# Altium schematic sheet PowerControl.SchDoc
size C
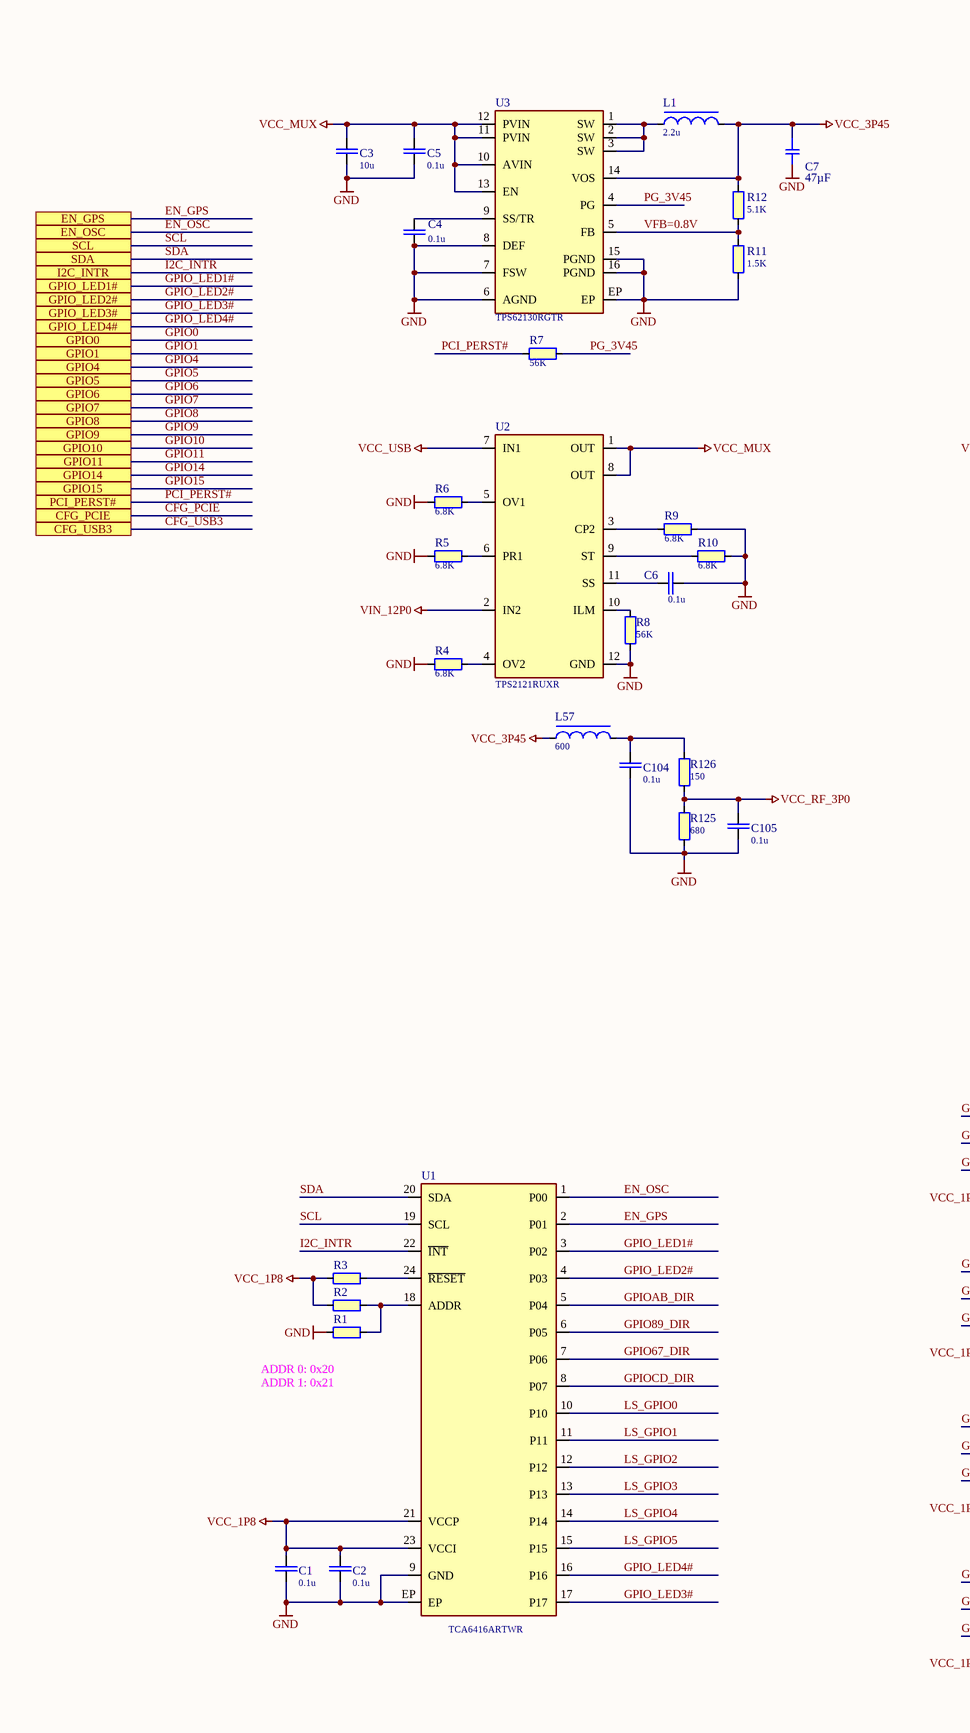
[diagram p0: PowerControl.SchDoc, left]
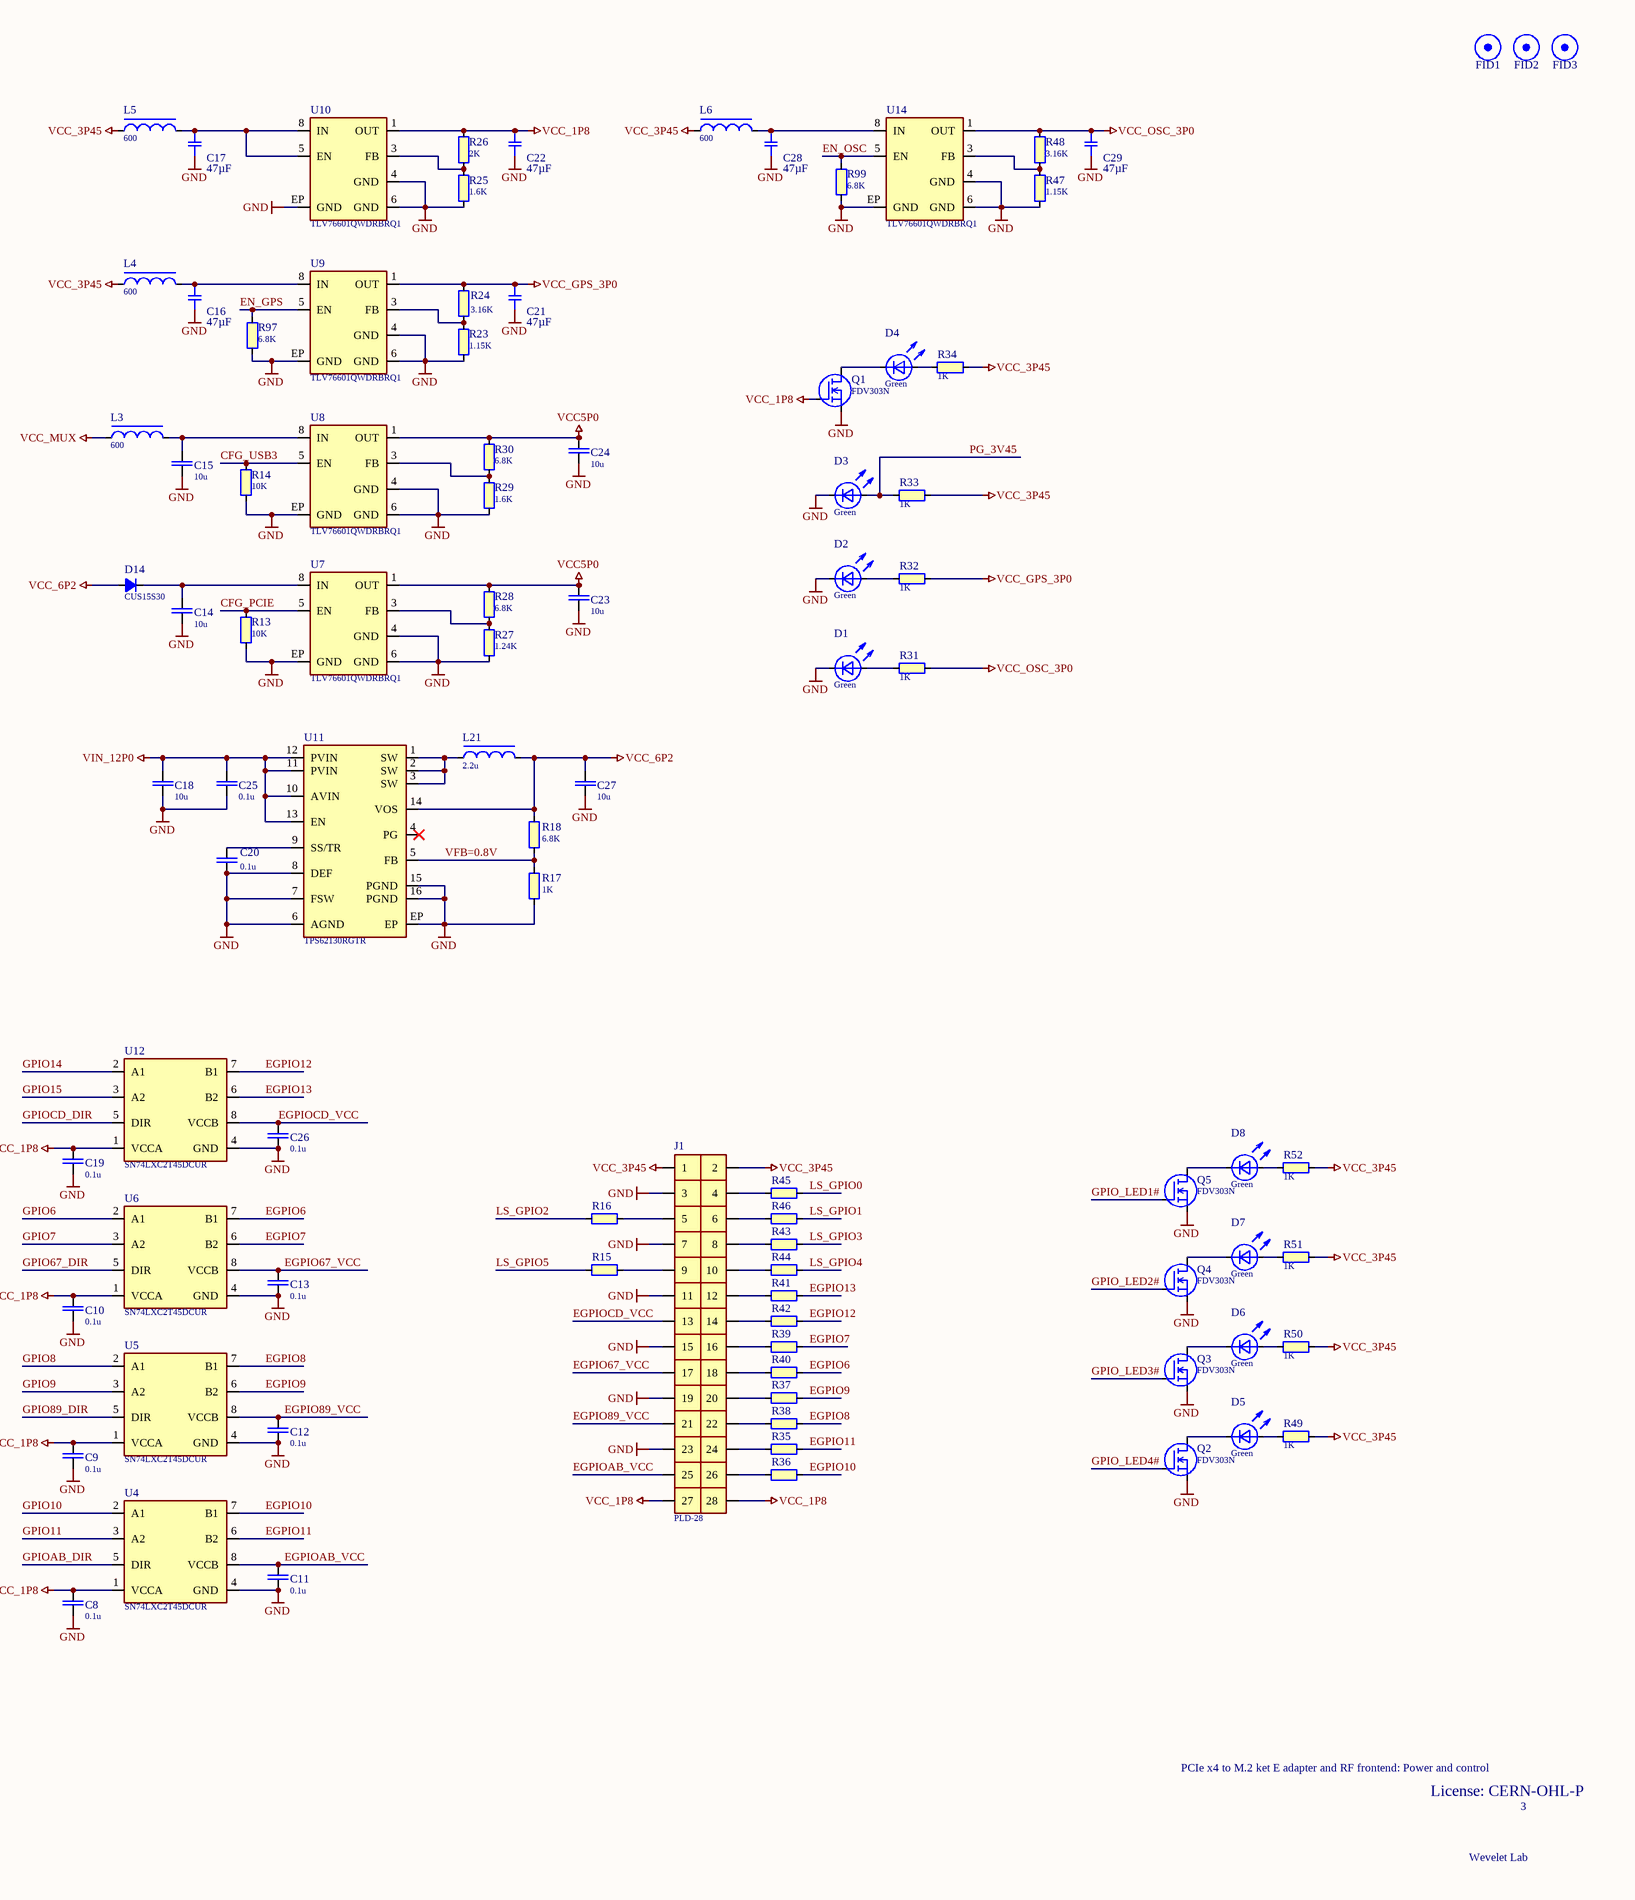
[diagram p1: PowerControl.SchDoc, right]

## Parts
C1  value 0.1u  [CAPC100X50X55L25N]  (hidden comment: GRM155R71E104KE14D)
C2  value 0.1u  [CAPC100X50X55L25N]  (hidden comment: GRM155R71E104KE14D)
C3  value 10u  [CAPC160X80X100L40N]  (hidden comment: Cap-0603-X5R-25V-10u-20%)
C4  value 0.1u  [CAPC100X50X55L25N]  (hidden comment: GRM155R71E104KE14D)
C5  value 0.1u  [CAPC100X50X55L25N]  (hidden comment: GRM155R71E104KE14D)
C6  value 0.1u  [CAPC100X50X55L25N]  (hidden comment: GRM155R71E104KE14D)
C7  value 47µF  [SMD-0603-CAP_HighDensity]  (hidden comment: GRM188C80G476ME01D)
C8  value 0.1u  [CAPC100X50X55L25N]  (hidden comment: GRM155R71E104KE14D)
C9  value 0.1u  [CAPC100X50X55L25N]  (hidden comment: GRM155R71E104KE14D)
C10  value 0.1u  [CAPC100X50X55L25N]  (hidden comment: GRM155R71E104KE14D)
C11  value 0.1u  [CAPC100X50X55L25N]  (hidden comment: GRM155R71E104KE14D)
C12  value 0.1u  [CAPC100X50X55L25N]  (hidden comment: GRM155R71E104KE14D)
C13  value 0.1u  [CAPC100X50X55L25N]  (hidden comment: GRM155R71E104KE14D)
C14  value 10u  [CAPC160X80X100L40N]  (hidden comment: Cap-0603-X5R-25V-10u-20%)
C15  value 10u  [CAPC160X80X100L40N]  (hidden comment: Cap-0603-X5R-25V-10u-20%)
C16  value 47µF  [SMD-0603-CAP_HighDensity]  (hidden comment: GRM188C80G476ME01D)
C17  value 47µF  [SMD-0603-CAP_HighDensity]  (hidden comment: GRM188C80G476ME01D)
C18  value 10u  [CAPC160X80X100L40N]  (hidden comment: Cap-0603-X5R-25V-10u-20%)
C19  value 0.1u  [CAPC100X50X55L25N]  (hidden comment: GRM155R71E104KE14D)
C20  value 0.1u  [CAPC100X50X55L25N]  (hidden comment: GRM155R71E104KE14D)
C21  value 47µF  [SMD-0603-CAP_HighDensity]  (hidden comment: GRM188C80G476ME01D)
C22  value 47µF  [SMD-0603-CAP_HighDensity]  (hidden comment: GRM188C80G476ME01D)
C23  value 10u  [CAPC160X80X100L40N]  (hidden comment: Cap-0603-X5R-25V-10u-20%)
C24  value 10u  [CAPC160X80X100L40N]  (hidden comment: Cap-0603-X5R-25V-10u-20%)
C25  value 0.1u  [CAPC100X50X55L25N]  (hidden comment: GRM155R71E104KE14D)
C26  value 0.1u  [CAPC100X50X55L25N]  (hidden comment: GRM155R71E104KE14D)
C27  value 10u  [CAPC160X80X100L40N]  (hidden comment: Cap-0603-X5R-25V-10u-20%)
C28  value 47µF  [SMD-0603-CAP_HighDensity]  (hidden comment: GRM188C80G476ME01D)
C29  value 47µF  [SMD-0603-CAP_HighDensity]  (hidden comment: GRM188C80G476ME01D)
C104  value 0.1u  [CAPC100X50X55L25N]  (hidden comment: GRM155R71E104KE14D)
C105  value 0.1u  [CAPC100X50X55L25N]  (hidden comment: GRM155R71E104KE14D)
D1  value Green  [LEDC160X80X80L40N-Green]  (hidden comment: LTST-C190KGKT)
D2  value Green  [LEDC160X80X80L40N-Green]  (hidden comment: LTST-C190KGKT)
D3  value Green  [LEDC160X80X80L40N-Green]  (hidden comment: LTST-C190KGKT)
D4  value Green  [LEDC160X80X80L40N-Green]  (hidden comment: LTST-C190KGKT)
D5  value Green  [LEDC160X80X80L40N-Green]  (hidden comment: LTST-C190KGKT)
D6  value Green  [LEDC160X80X80L40N-Green]  (hidden comment: LTST-C190KGKT)
D7  value Green  [LEDC160X80X80L40N-Green]  (hidden comment: LTST-C190KGKT)
D8  value Green  [LEDC160X80X80L40N-Green]  (hidden comment: LTST-C190KGKT)
D14  value CUS15S30  [INDC100X60X60L30N]  (hidden comment: CUS15S30,H3F)
FID1  Fiducial  [Fiducial_3D]  (value not drawn)  (no BOM)
FID2  Fiducial  [Fiducial_3D]  (value not drawn)  (no BOM)
FID3  Fiducial  [Fiducial_3D]  (value not drawn)  (no BOM)
J1  PLD-28  [PLD-28]
L1  value 2.2u  [IND_TAIYO_NRS5020]  (hidden comment: NRS5020T2R2NMGJ)
L3  value 600  [INDC100X60X60L30N]  (hidden comment: BLM15HG601SN1D)
L4  value 600  [INDC100X60X60L30N]  (hidden comment: BLM15HG601SN1D)
L5  value 600  [INDC100X60X60L30N]  (hidden comment: BLM15HG601SN1D)
L6  value 600  [INDC100X60X60L30N]  (hidden comment: BLM15HG601SN1D)
L21  value 2.2u  [IND_TAIYO_NRS5020]  (hidden comment: NRS5020T2R2NMGJ)
L57  value 600  [INDC100X60X60L30N]  (hidden comment: BLM15HG601SN1D)
Q1  FDV303N  [SOT23-3P95_245X110L45X44N]
Q2  FDV303N  [SOT23-3P95_245X110L45X44N]
Q3  FDV303N  [SOT23-3P95_245X110L45X44N]
Q4  FDV303N  [SOT23-3P95_245X110L45X44N]
Q5  FDV303N  [SOT23-3P95_245X110L45X44N]
R1  value DNP  [RESC100X50X40L20N]  (hidden comment: Res-0402-DNP)  (no BOM)
R2  value 33  [RESC100X50X40L20N]  (hidden comment: RC0402FR-0733RL)
R3  value 6.8K  [RESC100X50X40L20N]  (hidden comment: RC0402FR-076K8L)
R4  value 6.8K  [RESC100X50X40L20N]  (hidden comment: RC0402FR-076K8L)
R5  value 6.8K  [RESC100X50X40L20N]  (hidden comment: RC0402FR-076K8L)
R6  value 6.8K  [RESC100X50X40L20N]  (hidden comment: RC0402FR-076K8L)
R7  value 56K  [RESC100X50X40L20N]  (hidden comment: RC0402FR-0756KL)
R8  value 56K  [RESC100X50X40L20N]  (hidden comment: RC0402FR-0756KL)
R9  value 6.8K  [RESC100X50X40L20N]  (hidden comment: RC0402FR-076K8L)
R10  value 6.8K  [RESC100X50X40L20N]  (hidden comment: RC0402FR-076K8L)
R11  value 1.5K  [RESC100X50X40L20N]  (hidden comment: RC0402FR-071K5L)
R12  value 5.1K  [RESC100X50X40L20N]  (hidden comment: RC0402FR-075K1L)
R13  value 10K  [RESC100X50X40L20N]  (hidden comment: RC0402FR-0710KL)
R14  value 10K  [RESC100X50X40L20N]  (hidden comment: RC0402FR-0710KL)
R15  value 33  [RESC100X50X40L20N]  (hidden comment: RC0402FR-0733RL)
R16  value 33  [RESC100X50X40L20N]  (hidden comment: RC0402FR-0733RL)
R17  value 1K  [RESC100X50X40L20N]  (hidden comment: RC0402FR-071KL)
R18  value 6.8K  [RESC100X50X40L20N]  (hidden comment: RC0402FR-076K8L)
R23  value 1.15K  [RESC100X50X40L20N]  (hidden comment: RC0402FR-071K15L)
R24  value 3.16K  [RESC100X50X40L20N]  (hidden comment: RC0402FR-073K16L)
R25  value 1.6K  [RESC100X50X40L20N]  (hidden comment: RC0402FR-071K6L)
R26  value 2K  [RESC100X50X40L20N]  (hidden comment: RC0402FR-072KL)
R27  value 1.24K  [RESC100X50X40L20N]  (hidden comment: RC0402FR-071K24L)
R28  value 6.8K  [RESC100X50X40L20N]  (hidden comment: RC0402FR-076K8L)
R29  value 1.6K  [RESC100X50X40L20N]  (hidden comment: RC0402FR-071K6L)
R30  value 6.8K  [RESC100X50X40L20N]  (hidden comment: RC0402FR-076K8L)
R31  value 1K  [RESC100X50X40L20N]  (hidden comment: RC0402FR-071KL)
R32  value 1K  [RESC100X50X40L20N]  (hidden comment: RC0402FR-071KL)
R33  value 1K  [RESC100X50X40L20N]  (hidden comment: RC0402FR-071KL)
R34  value 1K  [RESC100X50X40L20N]  (hidden comment: RC0402FR-071KL)
R35  value 33  [RESC100X50X40L20N]  (hidden comment: RC0402FR-0733RL)
R36  value 33  [RESC100X50X40L20N]  (hidden comment: RC0402FR-0733RL)
R37  value 33  [RESC100X50X40L20N]  (hidden comment: RC0402FR-0733RL)
R38  value 33  [RESC100X50X40L20N]  (hidden comment: RC0402FR-0733RL)
R39  value 33  [RESC100X50X40L20N]  (hidden comment: RC0402FR-0733RL)
R40  value 33  [RESC100X50X40L20N]  (hidden comment: RC0402FR-0733RL)
R41  value 33  [RESC100X50X40L20N]  (hidden comment: RC0402FR-0733RL)
R42  value 33  [RESC100X50X40L20N]  (hidden comment: RC0402FR-0733RL)
R43  value 33  [RESC100X50X40L20N]  (hidden comment: RC0402FR-0733RL)
R44  value 33  [RESC100X50X40L20N]  (hidden comment: RC0402FR-0733RL)
R45  value 33  [RESC100X50X40L20N]  (hidden comment: RC0402FR-0733RL)
R46  value 33  [RESC100X50X40L20N]  (hidden comment: RC0402FR-0733RL)
R47  value 1.15K  [RESC100X50X40L20N]  (hidden comment: RC0402FR-071K15L)
R48  value 3.16K  [RESC100X50X40L20N]  (hidden comment: RC0402FR-073K16L)
R49  value 1K  [RESC100X50X40L20N]  (hidden comment: RC0402FR-071KL)
R50  value 1K  [RESC100X50X40L20N]  (hidden comment: RC0402FR-071KL)
R51  value 1K  [RESC100X50X40L20N]  (hidden comment: RC0402FR-071KL)
R52  value 1K  [RESC100X50X40L20N]  (hidden comment: RC0402FR-071KL)
R97  value 6.8K  [RESC100X50X40L20N]  (hidden comment: RC0402FR-076K8L)
R99  value 6.8K  [RESC100X50X40L20N]  (hidden comment: RC0402FR-076K8L)
R125  value 680  [RESC100X50X40L20N]  (hidden comment: RC0402FR-07680RL)
R126  value 150  [RESC100X50X40L20N]  (hidden comment: RC0402FR-07150RL)
U1  TCA6416ARTWR  [QFN25P50_400X400X80L40X24T250N]
U2  TPS2121RUXR  [QFN12P50_250X200X100L40X20N]
U3  TPS62130RGTR  [QFN17P50_300X300X100L40X24T170N]
U4  SN74LXC2T45DCUR  [SOP8P50_200X310X90L27X21N]
U5  SN74LXC2T45DCUR  [SOP8P50_200X310X90L27X21N]
U6  SN74LXC2T45DCUR  [SOP8P50_200X310X90L27X21N]
U7  TLV76601QWDRBRQ1  [SON9P65_300X300X100L40X31T250X175N]
U8  TLV76601QWDRBRQ1  [SON9P65_300X300X100L40X31T250X175N]
U9  TLV76601QWDRBRQ1  [SON9P65_300X300X100L40X31T250X175N]
U10  TLV76601QWDRBRQ1  [SON9P65_300X300X100L40X31T250X175N]
U11  TPS62130RGTR  [QFN17P50_300X300X100L40X24T170N]
U12  SN74LXC2T45DCUR  [SOP8P50_200X310X90L27X21N]
U14  TLV76601QWDRBRQ1  [SON9P65_300X300X100L40X31T250X175N]

## Ports
CFG_PCIE, CFG_USB3, EN_GPS, EN_OSC, GPIO0, GPIO1, GPIO4, GPIO5, GPIO6, GPIO7, GPIO8, GPIO9, GPIO10, GPIO11, GPIO14, GPIO15, GPIO_LED1#, GPIO_LED2#, GPIO_LED3#, GPIO_LED4#, I2C_INTR, PCI_PERST#, SCL, SDA

## Nets
GND: C1.1 C2.1 C3.2 C4.2 C5.2 C6.2 C7.2 C8.2 C9.2 C10.2 C11.1 C12.1 C13.1 C14.2 C15.2 C16.2 C17.2 C18.2 C19.2 C20.2 C21.2 C22.2 C23.2 C24.2 C25.2 C26.1 C27.2 C28.2 C29.2 C104.2 C105.2 D1.C D2.C D3.C J1.3 J1.7 J1.11 J1.15 J1.19 J1.23 Q1.2(S) Q2.2(S) Q3.2(S) Q4.2(S) Q5.2(S) R1.1 R4.1 R5.1 R6.1 R8.1 R9.2 R10.2 R11.1 R13.1 R14.1 R17.1 R23.1 R25.1 R27.1 R29.1 R47.1 R97.1 R99.1 R125.1 U1.9(GND) U1.EP U2.12(GND) U3.6(AGND) U3.7(FSW) U3.8(DEF) U3.15(PGND) U3.16(PGND) U3.EP U4.4(GND) U5.4(GND) U6.4(GND) U7.4(GND) U7.6(GND) U7.EP(GND) U8.4(GND) U8.6(GND) U8.EP(GND) U9.4(GND) U9.6(GND) U9.EP(GND) U10.4(GND) U10.6(GND) U10.EP(GND) U11.6(AGND) U11.7(FSW) U11.8(DEF) U11.15(PGND) U11.16(PGND) U11.EP U12.4(GND) U14.4(GND) U14.6(GND) U14.EP(GND)
VCC5P0: C23.1 C24.1 R28.2 R30.2 U7.1(OUT) U8.1(OUT)
VCC_1P8: C1.2 C2.2 C8.1 C9.1 C10.1 C19.1 C22.1 J1.27 J1.28 Q1.1(G) R2.1 R3.1 R26.2 U1.21(VCCP) U1.23(VCCI) U4.1(VCCA) U5.1(VCCA) U6.1(VCCA) U10.1(OUT) U12.1(VCCA)
VCC_3P45: C7.1 J1.1 J1.2 L1.2 L4.1 L5.1 L6.1 L57.1 R12.2 R33.2 R34.2 R49.2 R50.2 R51.2 R52.2 U3.14(VOS)
VCC_6P2: C27.1 D14.A L21.2 R18.2 U11.14(VOS)
VCC_GPS_3P0: C21.1 R24.2 R32.2 U9.1(OUT)
VCC_MUX: C3.1 C5.1 L3.1 U2.1(OUT) U2.8(OUT) U3.10(AVIN) U3.11(PVIN) U3.12(PVIN) U3.13(EN)
VCC_OSC_3P0: C29.1 R31.2 R48.2 U14.1(OUT)
VCC_RF_3P0: C105.1 R125.2 R126.1
VCC_USB: U2.7(IN1)
VIN_12P0: C18.1 C25.1 U2.2(IN2) U11.10(AVIN) U11.11(PVIN) U11.12(PVIN) U11.13(EN)
CFG_PCIE: R13.2 U7.5(EN) ; port CFG_PCIE
CFG_USB3: R14.2 U8.5(EN) ; port CFG_USB3
EGPIO6: R40.2 U6.7(B1)
EGPIO7: R39.2 U6.6(B2)
EGPIO8: R38.2 U5.7(B1)
EGPIO9: R37.2 U5.6(B2)
EGPIO10: R36.2 U4.7(B1)
EGPIO11: R35.2 U4.6(B2)
EGPIO12: R42.2 U12.7(B1)
EGPIO13: R41.2 U12.6(B2)
EGPIO67_VCC: C13.2 J1.17 U6.8(VCCB)
EGPIO89_VCC: C12.2 J1.21 U5.8(VCCB)
EGPIOAB_VCC: C11.2 J1.25 U4.8(VCCB)
EGPIOCD_VCC: C26.2 J1.13 U12.8(VCCB)
EN_GPS: R97.2 U1.2(P01) U9.5(EN) ; port EN_GPS
EN_OSC: R99.2 U1.1(P00) U14.5(EN) ; port EN_OSC
GPIO0: port GPIO0
GPIO1: port GPIO1
GPIO4: port GPIO4
GPIO5: port GPIO5
GPIO6: U6.2(A1) ; port GPIO6
GPIO7: U6.3(A2) ; port GPIO7
GPIO8: U5.2(A1) ; port GPIO8
GPIO9: U5.3(A2) ; port GPIO9
GPIO10: U4.2(A1) ; port GPIO10
GPIO11: U4.3(A2) ; port GPIO11
GPIO14: U12.2(A1) ; port GPIO14
GPIO15: U12.3(A2) ; port GPIO15
GPIO67_DIR: U1.7(P06) U6.5(DIR)
GPIO89_DIR: U1.6(P05) U5.5(DIR)
GPIO_LED1#: Q5.1(G) U1.3(P02) ; port GPIO_LED1#
GPIO_LED2#: Q4.1(G) U1.4(P03) ; port GPIO_LED2#
GPIO_LED3#: Q3.1(G) U1.17(P17) ; port GPIO_LED3#
GPIO_LED4#: Q2.1(G) U1.16(P16) ; port GPIO_LED4#
GPIOAB_DIR: U1.5(P04) U4.5(DIR)
GPIOCD_DIR: U1.8(P07) U12.5(DIR)
I2C_INTR: U1.22(~{INT}) ; port I2C_INTR
LS_GPIO0: R45.2 U1.10(P10)
LS_GPIO1: R46.2 U1.11(P11)
LS_GPIO2: R16.1 U1.12(P12)
LS_GPIO3: R43.2 U1.13(P13)
LS_GPIO4: R44.2 U1.14(P14)
LS_GPIO5: R15.1 U1.15(P15)
PCI_PERST#: R7.1 ; port PCI_PERST#
PG_3V45: D3.A R7.2 R33.1 U3.4(PG)
SCL: U1.19(SCL) ; port SCL
SDA: U1.20(SDA) ; port SDA
NetC4_1: C4.1 U3.9(SS/TR)
NetC6_1: C6.1 U2.11(SS)
NetC14_1: C14.1 D14.C U7.8(IN)
NetC15_1: C15.1 L3.2 U8.8(IN)
NetC16_1: C16.1 L4.2 U9.8(IN)
NetC17_1: C17.1 L5.2 U10.5(EN) U10.8(IN)
NetC20_1: C20.1 U11.9(SS/TR)
NetC28_1: C28.1 L6.2 U14.8(IN)
NetC104_1: C104.1 L57.2 R126.2
NetD1_A: D1.A R31.1
NetD2_A: D2.A R32.1
NetD4_A: D4.A R34.1
NetD4_C: D4.C Q1.3(D)
NetD5_A: D5.A R49.1
NetD5_C: D5.C Q2.3(D)
NetD6_A: D6.A R50.1
NetD6_C: D6.C Q3.3(D)
NetD7_A: D7.A R51.1
NetD7_C: D7.C Q4.3(D)
NetD8_A: D8.A R52.1
NetD8_C: D8.C Q5.3(D)
NetJ1_4: J1.4 R45.1
NetJ1_5: J1.5 R16.2
NetJ1_6: J1.6 R46.1
NetJ1_8: J1.8 R43.1
NetJ1_9: J1.9 R15.2
NetJ1_10: J1.10 R44.1
NetJ1_12: J1.12 R41.1
NetJ1_14: J1.14 R42.1
NetJ1_16: J1.16 R39.1
NetJ1_18: J1.18 R40.1
NetJ1_20: J1.20 R37.1
NetJ1_22: J1.22 R38.1
NetJ1_24: J1.24 R35.1
NetJ1_26: J1.26 R36.1
NetL1_1: L1.1 U3.1(SW) U3.2(SW) U3.3(SW)
NetL21_1: L21.1 U11.1(SW) U11.2(SW) U11.3(SW)
NetR1_2: R1.2 R2.2 U1.18(ADDR)
NetR3_2: R3.2 U1.24(~{RESET})
NetR4_2: R4.2 U2.4(OV2)
NetR5_2: R5.2 U2.6(PR1)
NetR6_2: R6.2 U2.5(OV1)
NetR8_2: R8.2 U2.10(ILM)
NetR9_1: R9.1 U2.3(CP2)
NetR10_1: R10.1 U2.9(ST)
NetR11_2: R11.2 R12.1 U3.5(FB)
NetR17_2: R17.2 R18.1 U11.5(FB)
NetR23_2: R23.2 R24.1 U9.3(FB)
NetR25_2: R25.2 R26.1 U10.3(FB)
NetR27_2: R27.2 R28.1 U7.3(FB)
NetR29_2: R29.2 R30.1 U8.3(FB)
NetR47_2: R47.2 R48.1 U14.3(FB)

Not connected (* = marked no-connect by the designer): U11 4(PG)*

## Notes on the sheet
- VFB=0.8V
- (near R1) ADDR 0: 0x20
- (near R1) ADDR 1: 0x21
- PCIe x4 to M.2 ket E adapter and RF frontend: Power and control
- License: CERN-OHL-P
- Wevelet Lab
- 3

## Library data of the parts
C1 C2 C4-C6 C8-C13 C19 C20 C25 C26 C104 C105 = GRM155R71E104KE14D: Capacitor, 0.1u, 25V, 10%, X7R, 0402; Manufacturer: Murata Electronics
C3 C14 C15 C18 C23 C24 C27 = Cap-0603-X5R-25V-10u-20%: Capacitor, 10u, 25V, 20%, X5R, 0603; Manufacturer: *
C7 C16 C17 C21 C22 C28 C29 = GRM188C80G476ME01D: CAP CER 47UF 4V X6S 0603; Manufacturer: Murata Electronics North America; Tolerance: ±20%; Datasheets: https://www.murata.com/-/media/webrenewal/support/library/catalog/products/capacitor/ceramiccapacitor/c02e.ashx?la=en-us&cvid=20210120024548000000; Digi-Key Part Number: 490-13246-2-ND; Part Number: GRM188C80G476ME01D; Series: GRM; Part Status: Active; Voltage: 4V; Temperature Coefficient: X6S; Operating Temperature: -55°C ~ 105°C; Applications: General Purpose; Failure Rate: Surface Mount, MLCC; Mounting Type: 0603 (1608 Metric); Package / Case: 0.063" L x 0.031" W (1.60mm x 0.80mm)
D1-D8 = LTST-C190KGKT: LED Diode, Green, -30/+85, SMD0603; Manufacturer: Lite-On Inc.
D14 = CUS15S30: Diode, Schottky, 20V, 1.5A, 0.3Vf, -50/+125, SOD-323-2; Manufacturer: Toshiba
J1 = PLD-28: Conn, Header 12x2, 2.54mm, Trough Hole; Manufacturer: *; Value: PLD-28
L1 L21 = NRS5020T2R2NMGJ: Inductor, 2.2u, 2,9A, 42mOhm, +/-30%, -25/+125, SMD; Manufacturer: Taiyo Yuden
L3-L6 L57 = BLM15HG601SN1D: Ferrite bead, 600Ohm@100MHz, 0,3A, 700mOhm, -55/+125, SMD0402; Manufacturer: Murata Electronics; Name: BLM15HG601SN1D
Q1-Q5 = FDV303N: Transistor, MOSFET, N-CH, 25V, 0.68A, -55/+150, SOT-23; Manufacturer: Onsemi; Value: FDV303N
R1 = Res-0402-DNP: Resistor, DNP, 0.063W, 5%, 0402; Manufacturer: *
R2 R15 R16 R35-R46 = Res-0402-33-5%: Resistor, 33, 0.063W, 5%, 0402; Manufacturer: *; Name: RC0402FR-0733RL
R3-R6 R9 R10 R18 R28 R30 R97 R99 = Res-0402-6.8K-1%: Resistor, 6.8K, 0.063W, 1%, 0402; Manufacturer: *; Name: RC0402FR-076K8L
R7 R8 = Res-0402-56K-5%: Resistor, 56K, 0.063W, 5%, 0402; Manufacturer: *; Name: RC0402FR-0756KL
R11 = Res-0402-1.5K-1%: Resistor, 1.5K, 0.063W, 1%, 0402; Manufacturer: *; Name: RC0402FR-071K5L
R12 = Res-0402-5.1K-1%: Resistor, 5.1K, 0.063W, 1%, 0402; Manufacturer: *; Name: RC0402FR-075K1L
R13 R14 = Res-0402-10K-5%: Resistor, 10K, 0.063W, 5%, 0402; Manufacturer: *; Name: RC0402FR-0710KL
R17 R31-R34 R49-R52 = Res-0402-1K-5%: Resistor, 1K, 0.063W, 5%, 0402; Manufacturer: *; Name: RC0402FR-071KL
R23 R47 = Res-0402-1.15K-1%: Resistor, 1.15K, 0.063W, 1%, 0402; Manufacturer: *; Name: RC0402FR-071K15L
R24 R48 = Res-0402-3.16K-1%: Resistor, 3.16K, 0.063W, 1%, 0402; Manufacturer: *; Name: RC0402FR-073K16L
R25 R29 = Res-0402-1.6K-1%: Resistor, 1.6K, 0.063W, 1%, 0402; Manufacturer: *; Name: RC0402FR-071K6L
R26 = Res-0402-2K-1%: Resistor, 2K, 0.063W, 1%, 0402; Manufacturer: *; Name: RC0402FR-072KL
R27 = Res-0402-1.24K-1%: Resistor, 1.24K, 0.063W, 1%, 0402; Manufacturer: *; Name: RC0402FR-071K24L
R125 = Res-0402-680-5%: Resistor, 680, 0.063W, 5%, 0402; Manufacturer: *; Name: RC0402FR-07680RL
R126 = Res-0402-150-5%: Resistor, 150, 0.063W, 5%, 0402; Manufacturer: *; Name: RC0402FR-07150RL
U1 = TCA6416ARTWR: IC, Expander, 16-bit, 400KHZ, I2C, SMBUS, 1.65-5.5V, -40/+85, 24-WQFN (4x4); Manufacturer: TI; Value: TCA6416ARTWR
U2 = TPS2121RUXR: IC, QR controller, 2:1, 2.8/24V, 1/4.5A, -40/+125, VQFN-12; Manufacturer: Texas Instruments; Value: TPS2121RUXR
U3 U11 = TPS62130RGTR: IC, DC/DC, Step-Down, 3-17/0.9-6V, 3A, -40/+85, QFN-16; Manufacturer: Texas Instruments; Value: TPS62130RGTR
U4-U6 U12 = SN74LXC2T45DCUR: IC, Transceiver, Bidirectional, 1.1-5.5V, -40/+125, 8VSSOP; Manufacturer: TI; Value: SN74LXC2T45DCUR
U7-U10 U14 = TLV76601QWDRBRQ1: IC, VolReg, DC/DC, 2.5/16V, 0.8/14,6V, 0.5A, -40/+150, 8-SON; Manufacturer: Texas Instruments; Value: TLV76601QWDRBRQ1
FID1-FID3 = Fiducial: Manufacturer: *; Value: *